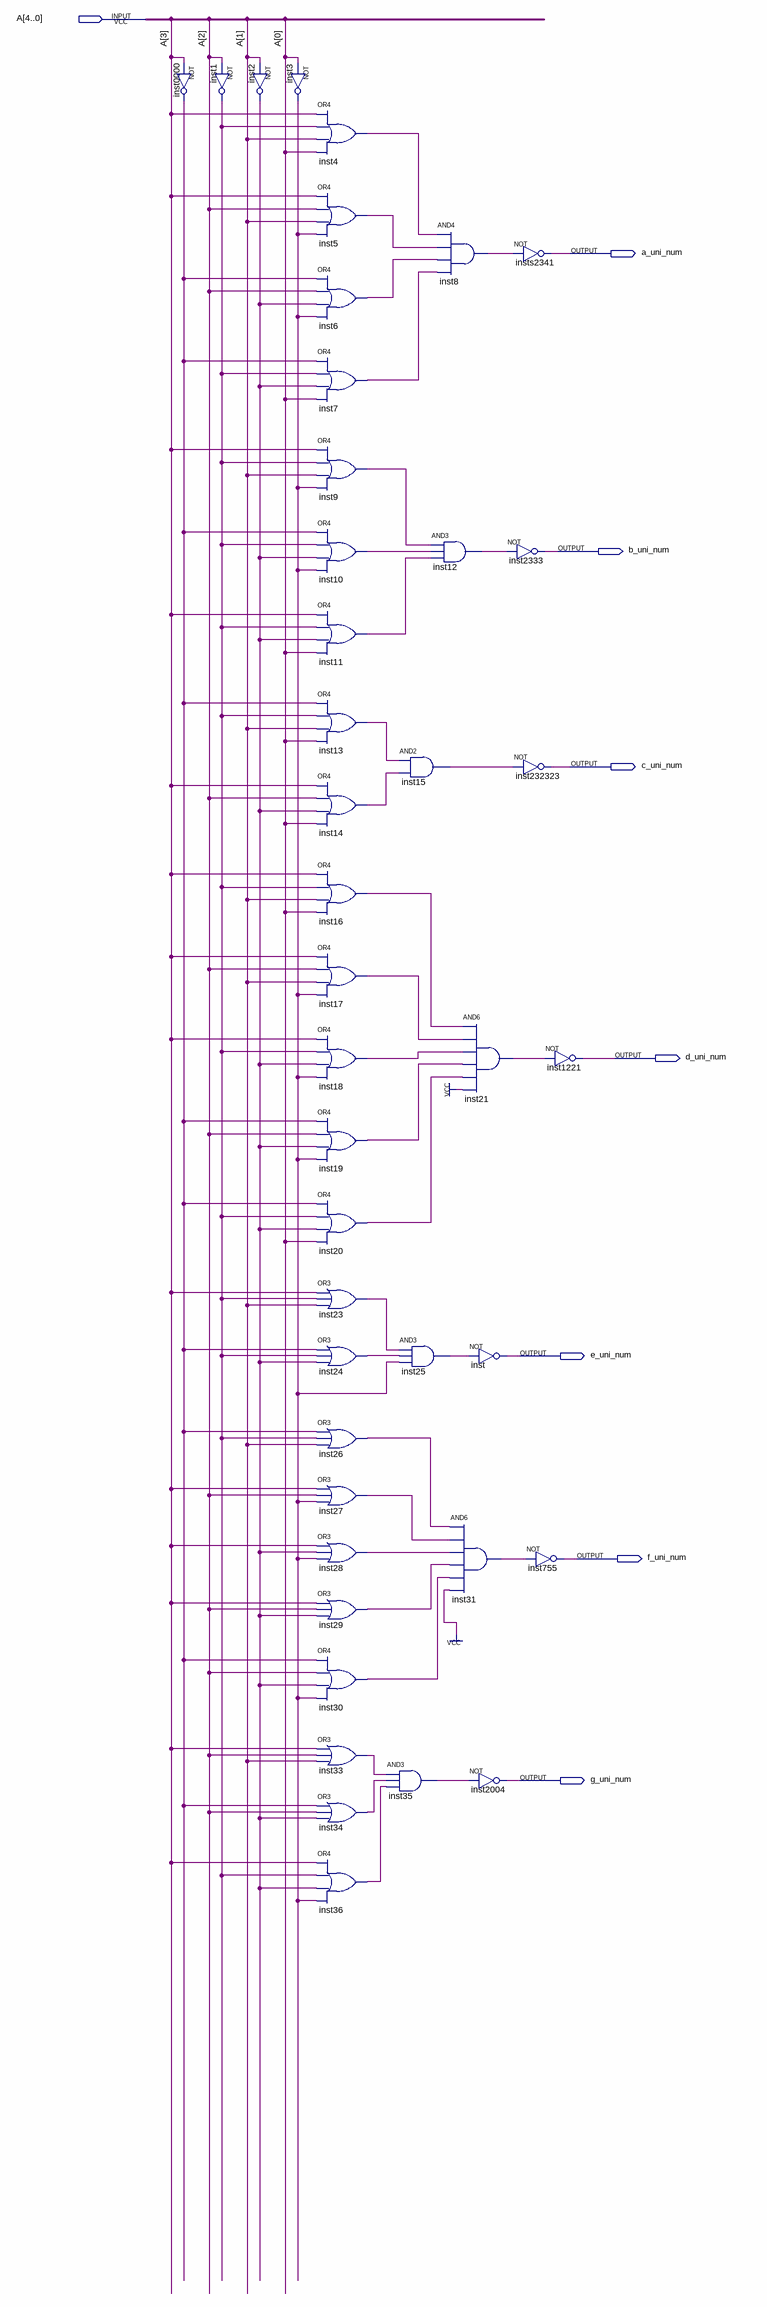
[diagram p0: schematic sheet]
// Quartus schematic Display_Unidades_4bits.bdf as structural Verilog: 42 symbols, 8 pins
module Display_Unidades_4bits (
  input  [4:0] A,
  output a_uni_num,
  output b_uni_num,
  output c_uni_num,
  output d_uni_num,
  output e_uni_num,
  output f_uni_num,
  output g_uni_num
);

  wire inst0000_out, inst1_out, inst2_out, inst3_out, inst4_out, inst5_out, inst6_out, inst7_out, inst8_out,
       inst9_out, inst10_out, inst11_out, inst12_out, inst13_out, inst14_out, inst15_out, inst16_out,
       inst17_out, inst18_out, inst19_out, inst20_out, inst21_out, inst23_out, inst24_out, inst25_out,
       inst26_out, inst27_out, inst28_out, inst29_out, inst30_out, inst31_out, inst33_out, inst34_out,
       inst35_out, inst36_out;

  not inst1 (inst1_out, A[2]);
  not inst0000 (inst0000_out, A[3]);
  not inst2 (inst2_out, A[1]);
  not inst3 (inst3_out, A[0]);
  or inst4 (inst4_out, A[3], inst1_out, A[1], A[0]);
  or inst5 (inst5_out, A[3], A[2], A[1], inst3_out);
  or inst6 (inst6_out, inst0000_out, A[2], inst2_out, inst3_out);
  or inst7 (inst7_out, inst0000_out, inst1_out, inst2_out, A[0]);
  or inst9 (inst9_out, A[3], inst1_out, A[1], inst3_out);
  or inst10 (inst10_out, inst0000_out, inst1_out, inst2_out, inst3_out);
  or inst11 (inst11_out, A[3], inst1_out, inst2_out, A[0]);
  or inst13 (inst13_out, inst0000_out, inst1_out, A[1], A[0]);
  or inst14 (inst14_out, A[3], A[2], inst2_out, A[0]);
  or inst16 (inst16_out, A[3], inst1_out, A[1], A[0]);
  or inst17 (inst17_out, A[3], A[2], A[1], inst3_out);
  or inst18 (inst18_out, A[3], inst1_out, inst2_out, inst3_out);
  or inst19 (inst19_out, inst0000_out, A[2], inst2_out, inst3_out);
  or inst20 (inst20_out, inst0000_out, inst1_out, inst2_out, A[0]);
  or inst23 (inst23_out, A[3], inst1_out, A[1]);
  or inst24 (inst24_out, inst0000_out, inst1_out, inst2_out);
  or inst26 (inst26_out, inst0000_out, inst1_out, A[1]);
  or inst27 (inst27_out, A[3], A[2], inst3_out);
  or inst28 (inst28_out, A[3], inst2_out, inst3_out);
  or inst29 (inst29_out, A[3], A[2], inst2_out);
  or inst30 (inst30_out, inst0000_out, A[2], inst2_out, inst3_out);
  or inst33 (inst33_out, A[3], A[2], A[1]);
  or inst34 (inst34_out, inst0000_out, A[2], inst2_out);
  or inst36 (inst36_out, A[3], inst1_out, inst2_out, inst3_out);
  and inst15 (inst15_out, inst13_out, inst14_out);
  and inst25 (inst25_out, inst23_out, inst24_out, inst3_out);
  and inst35 (inst35_out, inst33_out, inst34_out, inst36_out);
  and inst8 (inst8_out, inst4_out, inst5_out, inst6_out, inst7_out);
  and inst12 (inst12_out, inst9_out, inst10_out, inst11_out);
  and inst21 (inst21_out, inst16_out, inst17_out, inst18_out, inst19_out, inst20_out, 1'b1);
  and inst31 (inst31_out, inst26_out, inst27_out, inst28_out, inst29_out, inst30_out, 1'b1);
  not insts2341 (a_uni_num, inst8_out);
  not inst2333 (b_uni_num, inst12_out);
  not inst232323 (c_uni_num, inst15_out);
  not inst (e_uni_num, inst25_out);
  not inst2004 (g_uni_num, inst35_out);
  not inst1221 (d_uni_num, inst21_out);
  not inst755 (f_uni_num, inst31_out);
endmodule
